# Altium project 2015_ALIM_HITEC.PrjPcb
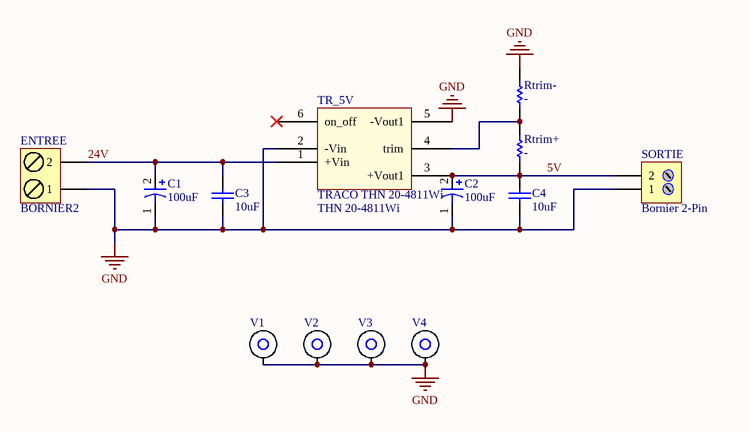
[diagram p0: 2015_ALIM_HITEC.SchDoc]
1 sheet, 13 parts. Net scope: global (net labels, ports and power ports of the same name join across sheets).
Board file: 2015_ALIM_HITEC.PcbDoc

## Sheet 2015_ALIM_HITEC.SchDoc
size A4

### Parts
C1  100uF  [CONDENSATEUR_POLARISE_ELECTROLYTIQUE_RADIAL_5.08/8.9]
C2  100uF  [CONDENSATEUR_POLARISE_ELECTROLYTIQUE_RADIAL_5.08/8.9]
C3  10uF  [C1206_N]
C4  10uF  [C1206_N]
ENTREE  BORNIER2  [BORNIER2_FEM_COUDE]
Rtrim+  -  [R1206_N]
Rtrim-  -  [R1206_N]
SORTIE  Bornier 2-Pin  [BORNIER2_HORIZ]
TR_5V  TRACO THN 20-4811Wi  Ref: THN 20-4811Wi  [TRACO_THN20]
V1  Entretoise WURTH CMS  [ENTRETOISE_CMS]  (value not drawn)
V2  Entretoise WURTH CMS  [ENTRETOISE_CMS]  (value not drawn)
V3  Entretoise WURTH CMS  [ENTRETOISE_CMS]  (value not drawn)
V4  Entretoise WURTH CMS  [ENTRETOISE_CMS]  (value not drawn)

### Nets
GND: C1.1 C2.1 C3.1 C4.1 ENTREE.1 Rtrim-.2 SORTIE.1 TR_5V.2(-Vin) TR_5V.5(-Vout1) V1.1 V2.1 V3.1 V4.1
5V: C2.2 C4.2 Rtrim+.1 SORTIE.2 TR_5V.3(+Vout1)
24V: C1.2 C3.2 ENTREE.2 TR_5V.1(+Vin)
NetRtrim+_2: Rtrim+.2 Rtrim-.1 TR_5V.4(trim)

Not connected (* = marked no-connect by the designer): TR_5V 6(on_off)*

### Library data of the parts
C1 C2 = Condensateur Polarise Traversant: Polarized Capacitor
C3 C4 = Capacitor: Published: 8-Jun-2000; LatestRevisionDate: 17-Jul-2002; LatestRevisionNote: Re-released for DXP Platform.; PackageReference: RAD-0.3; Publisher: Altium Limited
ENTREE = BORNIER2: Terminal blocks, 2 pins, pitch=5mm
Rtrim+ Rtrim- = Resistor: Published: 8-Jun-2000; LatestRevisionDate: 17-Jul-2002; LatestRevisionNote: Re-released for DXP Platform.; PackageReference: AXIAL-0.5; Publisher: Altium Limited
TR_5V = TRACO THN 20-4811Wi: Traco 20W 24V to 5V*4A
V1-V4 = Entretoise WURTH CMS: Entretoise Wurth; Publisher: Damien Guitton
SORTIE = Bornier 2-Pin: LatestRevisionDate: 17-Jul-2002; LatestRevisionNote: Re-released for DXP Platform.; Publisher: Altium Limited